# EAGLE design PatchPanel2015 (EAGLE 6.6.0)
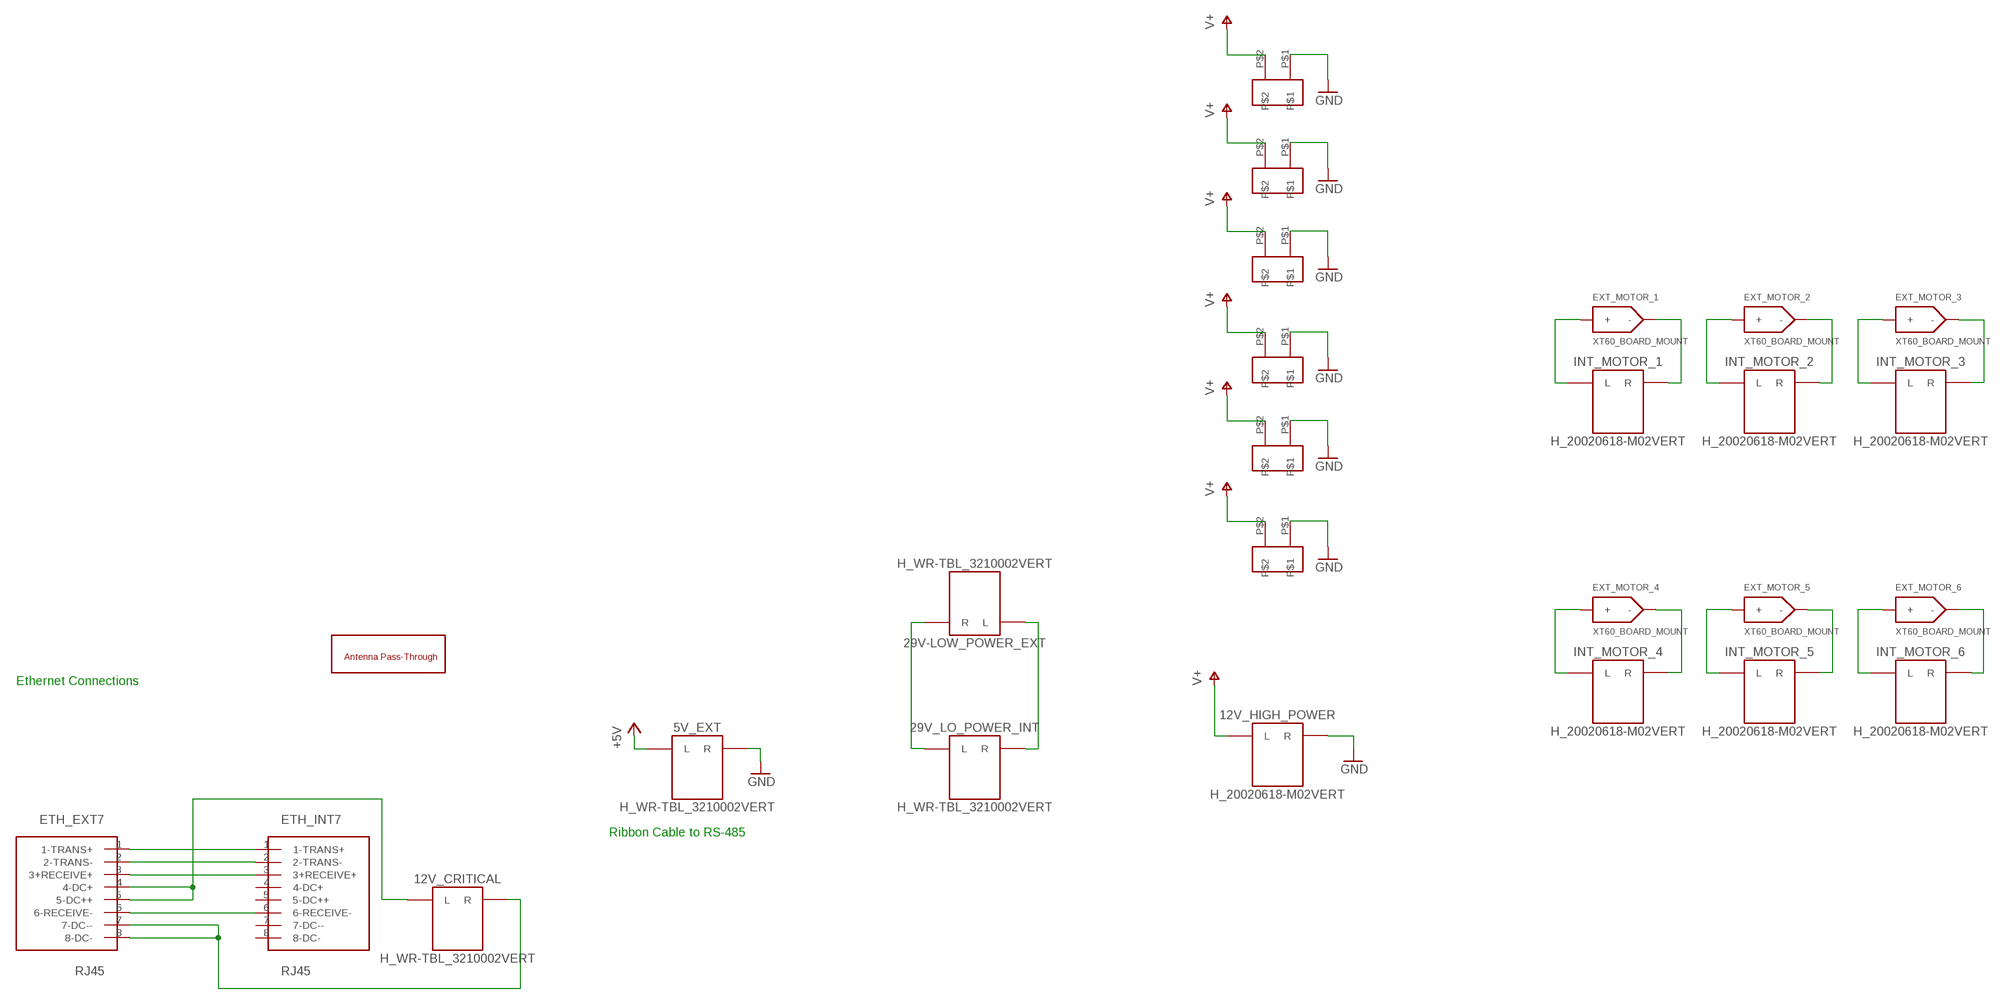
[diagram p0: schematic, sheet 1, part 1 of 2]
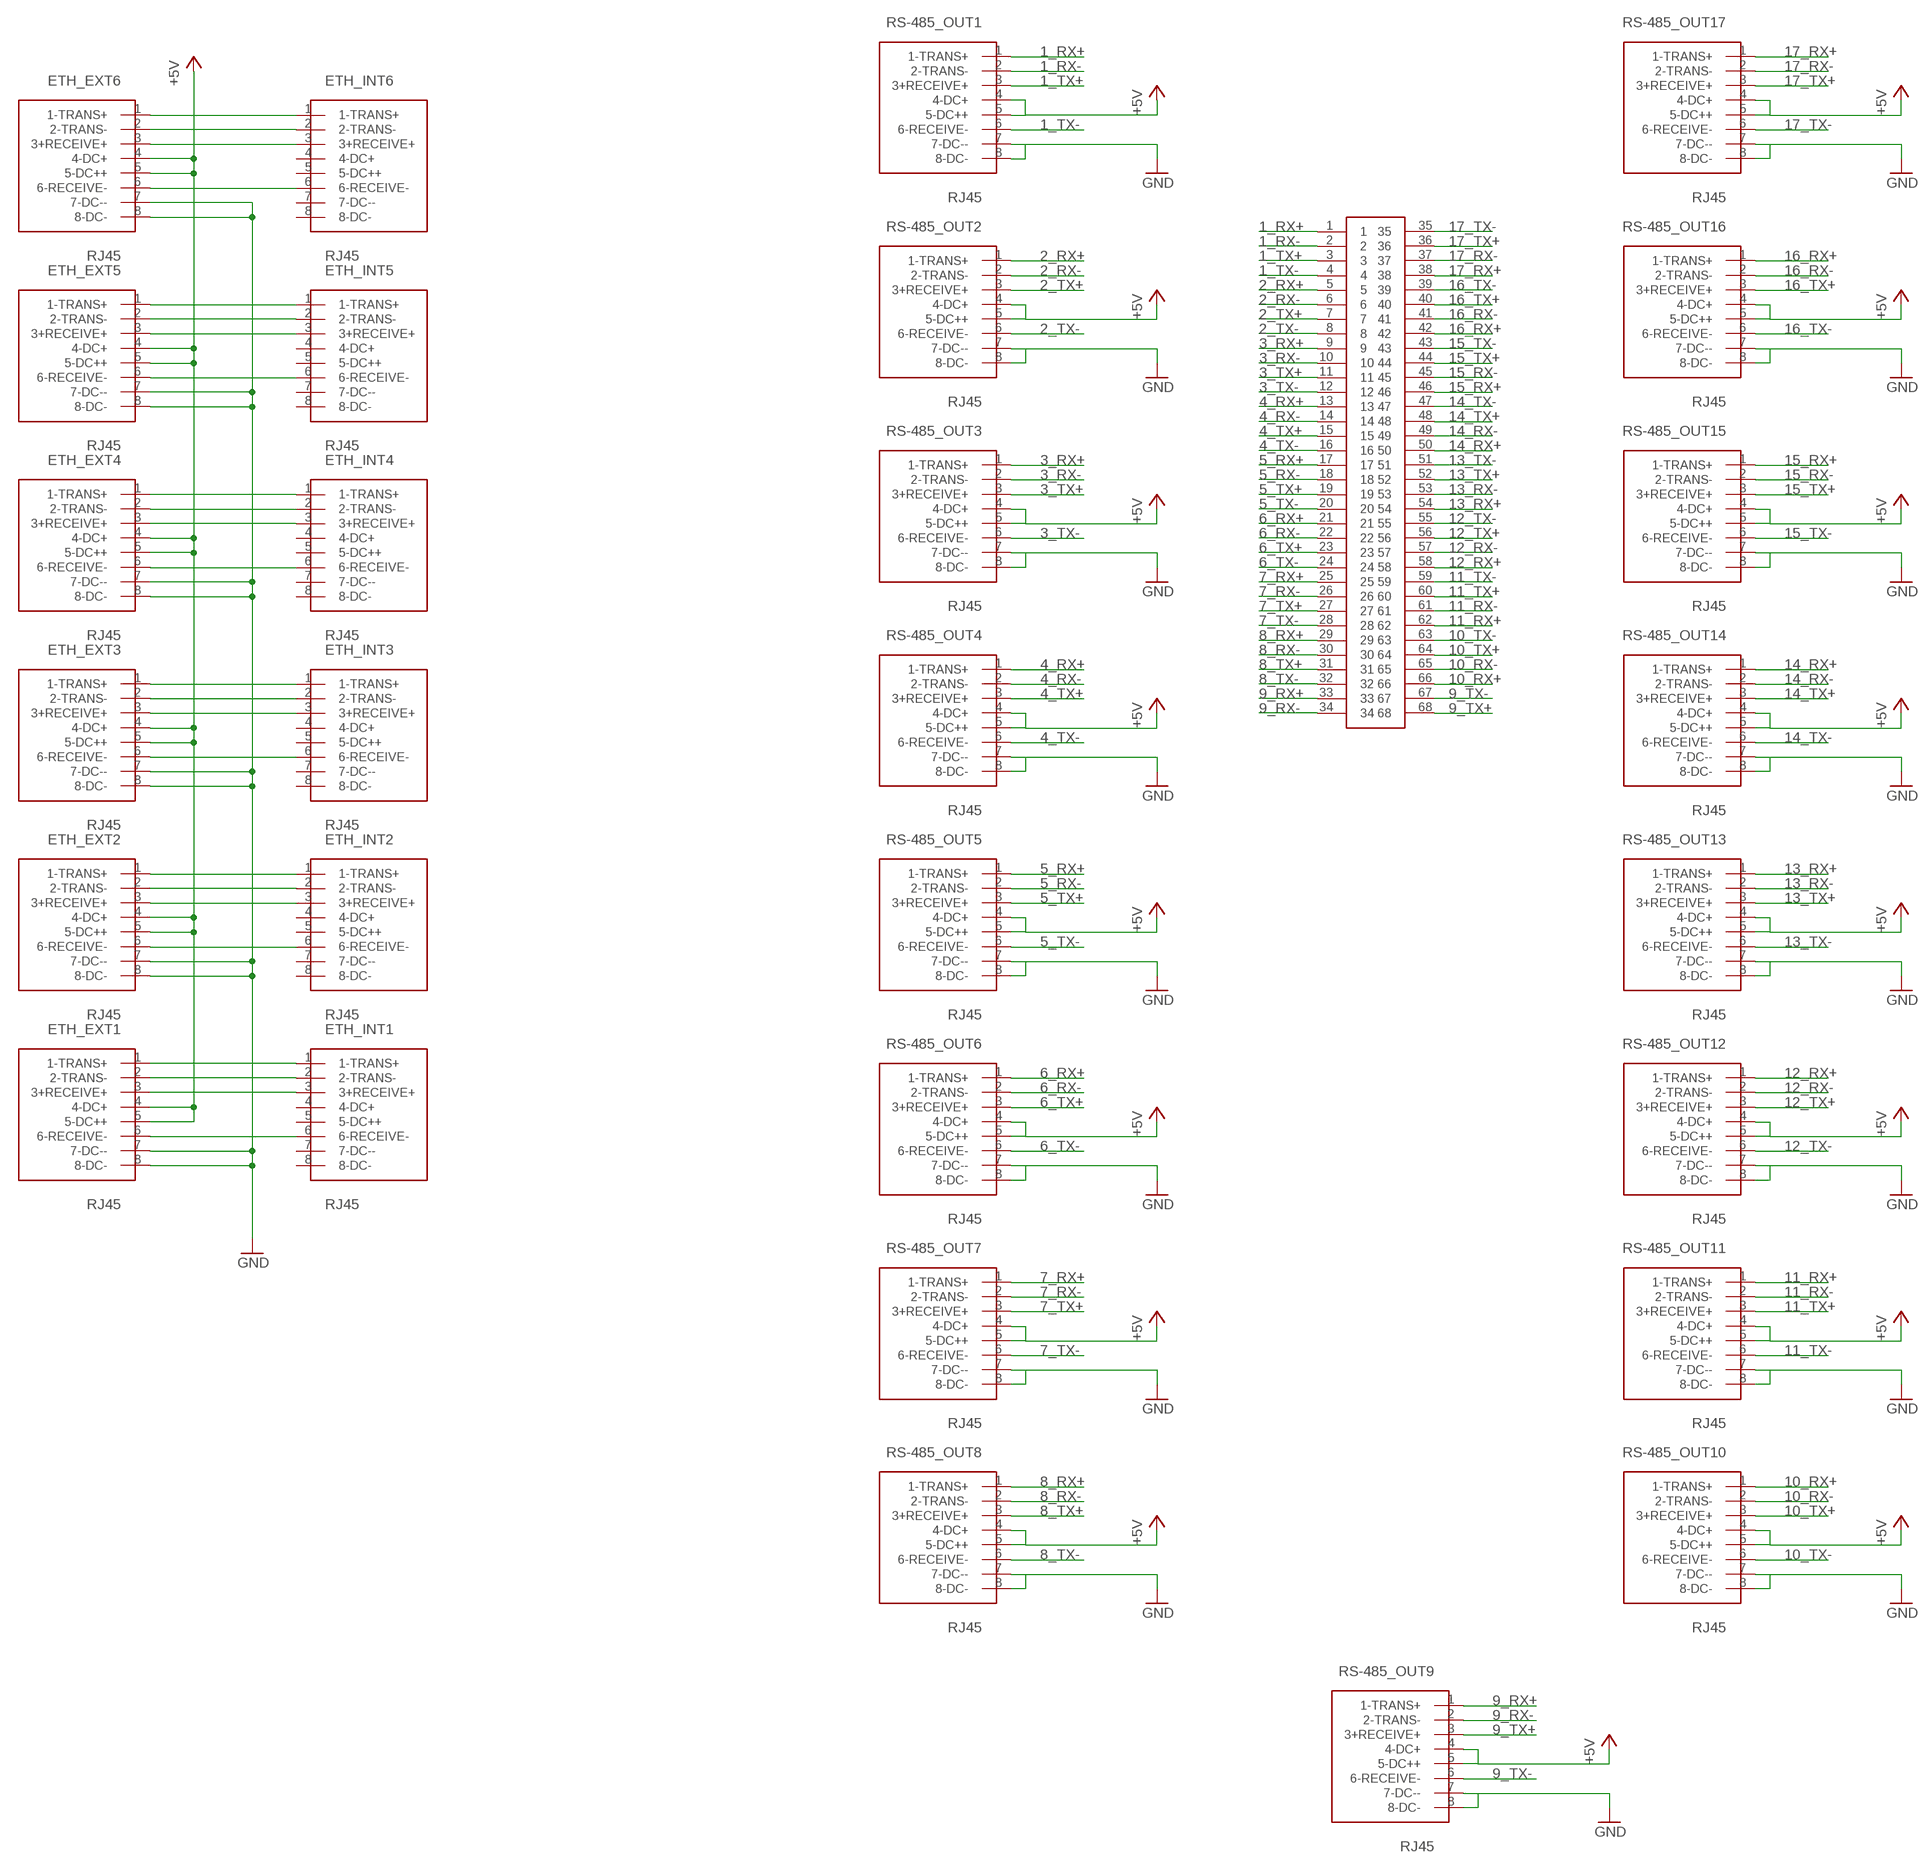
[diagram p1: schematic, sheet 1, part 2 of 2]

## Parts
5V_EXT  H_WR-TBL_3210002VERT  [691321100002]
12V_CRITICAL  H_WR-TBL_3210002VERT  [691321100002]
12V_HIGH_POWER  H_20020618-M02VERT  [20020620-M02]
29V-LOW_POWER_EXT  H_WR-TBL_3210002VERT  [691321100002]
29V_LO_POWER_INT  H_WR-TBL_3210002VERT  [691321100002]
ETH_EXT1  RJ45  [RJ45-CAT5E]
ETH_EXT2  RJ45  [RJ45-CAT5E]
ETH_EXT3  RJ45  [RJ45-CAT5E]
ETH_EXT4  RJ45  [RJ45-CAT5E]
ETH_EXT5  RJ45  [RJ45-CAT5E]
ETH_EXT6  RJ45  [RJ45-CAT5E]
ETH_EXT7  RJ45  [RJ45-CAT5E]
ETH_INT1  RJ45  [RJ45-CAT5E]
ETH_INT2  RJ45  [RJ45-CAT5E]
ETH_INT3  RJ45  [RJ45-CAT5E]
ETH_INT4  RJ45  [RJ45-CAT5E]
ETH_INT5  RJ45  [RJ45-CAT5E]
ETH_INT6  RJ45  [RJ45-CAT5E]
ETH_INT7  RJ45  [RJ45-CAT5E]
EXT_MOTOR_1  XT60_BOARD_MOUNT  [XT60_BOARD]
EXT_MOTOR_2  XT60_BOARD_MOUNT  [XT60_BOARD]
EXT_MOTOR_3  XT60_BOARD_MOUNT  [XT60_BOARD]
EXT_MOTOR_4  XT60_BOARD_MOUNT  [XT60_BOARD]
EXT_MOTOR_5  XT60_BOARD_MOUNT  [XT60_BOARD]
EXT_MOTOR_6  XT60_BOARD_MOUNT  [XT60_BOARD]
INT_MOTOR_1  H_20020618-M02VERT  [20020620-M02]
INT_MOTOR_2  H_20020618-M02VERT  [20020620-M02]
INT_MOTOR_3  H_20020618-M02VERT  [20020620-M02]
INT_MOTOR_4  H_20020618-M02VERT  [20020620-M02]
INT_MOTOR_5  H_20020618-M02VERT  [20020620-M02]
INT_MOTOR_6  H_20020618-M02VERT  [20020620-M02]
RS-485_OUT1  RJ45  [RJ45-CAT5E]
RS-485_OUT2  RJ45  [RJ45-CAT5E]
RS-485_OUT3  RJ45  [RJ45-CAT5E]
RS-485_OUT4  RJ45  [RJ45-CAT5E]
RS-485_OUT5  RJ45  [RJ45-CAT5E]
RS-485_OUT6  RJ45  [RJ45-CAT5E]
RS-485_OUT7  RJ45  [RJ45-CAT5E]
RS-485_OUT8  RJ45  [RJ45-CAT5E]
RS-485_OUT9  RJ45  [RJ45-CAT5E]
RS-485_OUT10  RJ45  [RJ45-CAT5E]
RS-485_OUT11  RJ45  [RJ45-CAT5E]
RS-485_OUT12  RJ45  [RJ45-CAT5E]
RS-485_OUT13  RJ45  [RJ45-CAT5E]
RS-485_OUT14  RJ45  [RJ45-CAT5E]
RS-485_OUT15  RJ45  [RJ45-CAT5E]
RS-485_OUT16  RJ45  [RJ45-CAT5E]
RS-485_OUT17  RJ45  [RJ45-CAT5E]
U$1  MLX-2  [42002-2]
U$2  MLX-2  [42002-2]
U$3  MLX-2  [42002-2]
U$4  TB60050685100  [60050685100]
U$5  MLX-2  [42002-2]
U$6  MLX-2  [42002-2]
U$8  MLX-2  [42002-2]
U$16  SMA-THRU  [SMA]

## Nets
1_RX+: RS-485_OUT1.1(1-TRANS+) U$4.1
1_RX-: RS-485_OUT1.2(2-TRANS-) U$4.2
1_TX+: RS-485_OUT1.3(3+RECEIVE+) U$4.3
1_TX-: RS-485_OUT1.6(6-RECEIVE-) U$4.4
2_RX+: RS-485_OUT2.1(1-TRANS+) U$4.5
2_RX-: RS-485_OUT2.2(2-TRANS-) U$4.6
2_TX+: RS-485_OUT2.3(3+RECEIVE+) U$4.7
2_TX-: RS-485_OUT2.6(6-RECEIVE-) U$4.8
3_RX+: RS-485_OUT3.1(1-TRANS+) U$4.9
3_RX-: RS-485_OUT3.2(2-TRANS-) U$4.10
3_TX+: RS-485_OUT3.3(3+RECEIVE+) U$4.11
3_TX-: RS-485_OUT3.6(6-RECEIVE-) U$4.12
4_RX+: RS-485_OUT4.1(1-TRANS+) U$4.13
4_RX-: RS-485_OUT4.2(2-TRANS-) U$4.14
4_TX+: RS-485_OUT4.3(3+RECEIVE+) U$4.15
4_TX-: RS-485_OUT4.6(6-RECEIVE-) U$4.16
5_RX+: RS-485_OUT5.1(1-TRANS+) U$4.17
5_RX-: RS-485_OUT5.2(2-TRANS-) U$4.18
5_TX+: RS-485_OUT5.3(3+RECEIVE+) U$4.19
5_TX-: RS-485_OUT5.6(6-RECEIVE-) U$4.20
6_RX+: RS-485_OUT6.1(1-TRANS+) U$4.21
6_RX-: RS-485_OUT6.2(2-TRANS-) U$4.22
6_TX+: RS-485_OUT6.3(3+RECEIVE+) U$4.23
6_TX-: RS-485_OUT6.6(6-RECEIVE-) U$4.24
7_RX+: RS-485_OUT7.1(1-TRANS+) U$4.25
7_RX-: RS-485_OUT7.2(2-TRANS-) U$4.26
7_TX+: RS-485_OUT7.3(3+RECEIVE+) U$4.27
7_TX-: RS-485_OUT7.6(6-RECEIVE-) U$4.28
8_RX+: RS-485_OUT8.1(1-TRANS+) U$4.29
8_RX-: RS-485_OUT8.2(2-TRANS-) U$4.30
8_TX+: RS-485_OUT8.3(3+RECEIVE+) U$4.31
8_TX-: RS-485_OUT8.6(6-RECEIVE-) U$4.32
9_RX+: RS-485_OUT9.1(1-TRANS+) U$4.33
9_RX-: RS-485_OUT9.2(2-TRANS-) U$4.34
9_TX+: RS-485_OUT9.3(3+RECEIVE+) U$4.68
9_TX-: RS-485_OUT9.6(6-RECEIVE-) U$4.67
10_RX+: RS-485_OUT10.1(1-TRANS+) U$4.66
10_RX-: RS-485_OUT10.2(2-TRANS-) U$4.65
10_TX+: RS-485_OUT10.3(3+RECEIVE+) U$4.64
10_TX-: RS-485_OUT10.6(6-RECEIVE-) U$4.63
11_RX+: RS-485_OUT11.1(1-TRANS+) U$4.62
11_RX-: RS-485_OUT11.2(2-TRANS-) U$4.61
11_TX+: RS-485_OUT11.3(3+RECEIVE+) U$4.60
11_TX-: RS-485_OUT11.6(6-RECEIVE-) U$4.59
12_RX+: RS-485_OUT12.1(1-TRANS+) U$4.58
12_RX-: RS-485_OUT12.2(2-TRANS-) U$4.57
12_TX+: RS-485_OUT12.3(3+RECEIVE+) U$4.56
12_TX-: RS-485_OUT12.6(6-RECEIVE-) U$4.55
13_RX+: RS-485_OUT13.1(1-TRANS+) U$4.54
13_RX-: RS-485_OUT13.2(2-TRANS-) U$4.53
13_TX+: RS-485_OUT13.3(3+RECEIVE+) U$4.52
13_TX-: RS-485_OUT13.6(6-RECEIVE-) U$4.51
14_RX+: RS-485_OUT14.1(1-TRANS+) U$4.50
14_RX-: RS-485_OUT14.2(2-TRANS-) U$4.49
14_TX+: RS-485_OUT14.3(3+RECEIVE+) U$4.48
14_TX-: RS-485_OUT14.6(6-RECEIVE-) U$4.47
15_RX+: RS-485_OUT15.1(1-TRANS+) U$4.46
15_RX-: RS-485_OUT15.2(2-TRANS-) U$4.45
15_TX+: RS-485_OUT15.3(3+RECEIVE+) U$4.44
15_TX-: RS-485_OUT15.6(6-RECEIVE-) U$4.43
16_RX+: RS-485_OUT16.1(1-TRANS+) U$4.42
16_RX-: RS-485_OUT16.2(2-TRANS-) U$4.41
16_TX+: RS-485_OUT16.3(3+RECEIVE+) U$4.40
16_TX-: RS-485_OUT16.6(6-RECEIVE-) U$4.39
17_RX+: RS-485_OUT17.1(1-TRANS+) U$4.38
17_RX-: RS-485_OUT17.2(2-TRANS-) U$4.37
17_TX+: RS-485_OUT17.3(3+RECEIVE+) U$4.36
17_TX-: RS-485_OUT17.6(6-RECEIVE-) U$4.35
+5V: 5V_EXT.L ETH_EXT1.4(4-DC+) ETH_EXT1.5(5-DC++) ETH_EXT2.4(4-DC+) ETH_EXT2.5(5-DC++) ETH_EXT3.4(4-DC+) ETH_EXT3.5(5-DC++) ETH_EXT4.4(4-DC+) ETH_EXT4.5(5-DC++) ETH_EXT5.4(4-DC+) ETH_EXT5.5(5-DC++) ETH_EXT6.4(4-DC+) ETH_EXT6.5(5-DC++) RS-485_OUT1.4(4-DC+) RS-485_OUT1.5(5-DC++) RS-485_OUT2.4(4-DC+) RS-485_OUT2.5(5-DC++) RS-485_OUT3.4(4-DC+) RS-485_OUT3.5(5-DC++) RS-485_OUT4.4(4-DC+) RS-485_OUT4.5(5-DC++) RS-485_OUT5.4(4-DC+) RS-485_OUT5.5(5-DC++) RS-485_OUT6.4(4-DC+) RS-485_OUT6.5(5-DC++) RS-485_OUT7.4(4-DC+) RS-485_OUT7.5(5-DC++) RS-485_OUT8.4(4-DC+) RS-485_OUT8.5(5-DC++) RS-485_OUT9.4(4-DC+) RS-485_OUT9.5(5-DC++) RS-485_OUT10.4(4-DC+) RS-485_OUT10.5(5-DC++) RS-485_OUT11.4(4-DC+) RS-485_OUT11.5(5-DC++) RS-485_OUT12.4(4-DC+) RS-485_OUT12.5(5-DC++) RS-485_OUT13.4(4-DC+) RS-485_OUT13.5(5-DC++) RS-485_OUT14.4(4-DC+) RS-485_OUT14.5(5-DC++) RS-485_OUT15.4(4-DC+) RS-485_OUT15.5(5-DC++) RS-485_OUT16.4(4-DC+) RS-485_OUT16.5(5-DC++) RS-485_OUT17.4(4-DC+) RS-485_OUT17.5(5-DC++)
GND: 5V_EXT.R 12V_HIGH_POWER.R1(R) 12V_HIGH_POWER.R2(R) ETH_EXT1.7(7-DC--) ETH_EXT1.8(8-DC-) ETH_EXT2.7(7-DC--) ETH_EXT2.8(8-DC-) ETH_EXT3.7(7-DC--) ETH_EXT3.8(8-DC-) ETH_EXT4.7(7-DC--) ETH_EXT4.8(8-DC-) ETH_EXT5.7(7-DC--) ETH_EXT5.8(8-DC-) ETH_EXT6.7(7-DC--) ETH_EXT6.8(8-DC-) RS-485_OUT1.7(7-DC--) RS-485_OUT1.8(8-DC-) RS-485_OUT2.7(7-DC--) RS-485_OUT2.8(8-DC-) RS-485_OUT3.7(7-DC--) RS-485_OUT3.8(8-DC-) RS-485_OUT4.7(7-DC--) RS-485_OUT4.8(8-DC-) RS-485_OUT5.7(7-DC--) RS-485_OUT5.8(8-DC-) RS-485_OUT6.7(7-DC--) RS-485_OUT6.8(8-DC-) RS-485_OUT7.7(7-DC--) RS-485_OUT7.8(8-DC-) RS-485_OUT8.7(7-DC--) RS-485_OUT8.8(8-DC-) RS-485_OUT9.7(7-DC--) RS-485_OUT9.8(8-DC-) RS-485_OUT10.7(7-DC--) RS-485_OUT10.8(8-DC-) RS-485_OUT11.7(7-DC--) RS-485_OUT11.8(8-DC-) RS-485_OUT12.7(7-DC--) RS-485_OUT12.8(8-DC-) RS-485_OUT13.7(7-DC--) RS-485_OUT13.8(8-DC-) RS-485_OUT14.7(7-DC--) RS-485_OUT14.8(8-DC-) RS-485_OUT15.7(7-DC--) RS-485_OUT15.8(8-DC-) RS-485_OUT16.7(7-DC--) RS-485_OUT16.8(8-DC-) RS-485_OUT17.7(7-DC--) RS-485_OUT17.8(8-DC-) U$1.P$1 U$2.P$1 U$3.P$1 U$5.P$1 U$6.P$1 U$8.P$1
N$1: ETH_EXT1.1(1-TRANS+) ETH_INT1.1(1-TRANS+)
N$2: ETH_EXT1.2(2-TRANS-) ETH_INT1.2(2-TRANS-)
N$3: ETH_EXT1.3(3+RECEIVE+) ETH_INT1.3(3+RECEIVE+)
N$4: EXT_MOTOR_1.POS(+) INT_MOTOR_1.L1(L) INT_MOTOR_1.L2(L)
N$5: EXT_MOTOR_1.NEG(-) INT_MOTOR_1.R1(R) INT_MOTOR_1.R2(R)
N$6: ETH_EXT1.6(6-RECEIVE-) ETH_INT1.6(6-RECEIVE-)
N$7: EXT_MOTOR_2.POS(+) INT_MOTOR_2.L1(L) INT_MOTOR_2.L2(L)
N$8: EXT_MOTOR_2.NEG(-) INT_MOTOR_2.R1(R) INT_MOTOR_2.R2(R)
N$9: ETH_EXT2.1(1-TRANS+) ETH_INT2.1(1-TRANS+)
N$10: ETH_EXT2.2(2-TRANS-) ETH_INT2.2(2-TRANS-)
N$11: ETH_EXT2.3(3+RECEIVE+) ETH_INT2.3(3+RECEIVE+)
N$12: EXT_MOTOR_3.POS(+) INT_MOTOR_3.L1(L) INT_MOTOR_3.L2(L)
N$13: EXT_MOTOR_3.NEG(-) INT_MOTOR_3.R1(R) INT_MOTOR_3.R2(R)
N$14: ETH_EXT2.6(6-RECEIVE-) ETH_INT2.6(6-RECEIVE-)
N$15: EXT_MOTOR_4.POS(+) INT_MOTOR_4.L1(L) INT_MOTOR_4.L2(L)
N$16: EXT_MOTOR_4.NEG(-) INT_MOTOR_4.R1(R) INT_MOTOR_4.R2(R)
N$17: ETH_EXT3.1(1-TRANS+) ETH_INT3.1(1-TRANS+)
N$18: ETH_EXT3.2(2-TRANS-) ETH_INT3.2(2-TRANS-)
N$19: ETH_EXT3.3(3+RECEIVE+) ETH_INT3.3(3+RECEIVE+)
N$20: EXT_MOTOR_5.POS(+) INT_MOTOR_5.L1(L) INT_MOTOR_5.L2(L)
N$21: EXT_MOTOR_5.NEG(-) INT_MOTOR_5.R1(R) INT_MOTOR_5.R2(R)
N$22: ETH_EXT3.6(6-RECEIVE-) ETH_INT3.6(6-RECEIVE-)
N$23: EXT_MOTOR_6.POS(+) INT_MOTOR_6.L1(L) INT_MOTOR_6.L2(L)
N$24: EXT_MOTOR_6.NEG(-) INT_MOTOR_6.R1(R) INT_MOTOR_6.R2(R)
N$25: 29V-LOW_POWER_EXT.R 29V_LO_POWER_INT.L
N$27: ETH_EXT4.6(6-RECEIVE-) ETH_INT4.6(6-RECEIVE-)
N$28: 29V-LOW_POWER_EXT.L 29V_LO_POWER_INT.R
N$29: 12V_CRITICAL.L ETH_EXT7.4(4-DC+) ETH_EXT7.5(5-DC++)
N$30: ETH_EXT4.3(3+RECEIVE+) ETH_INT4.3(3+RECEIVE+)
N$31: ETH_EXT4.2(2-TRANS-) ETH_INT4.2(2-TRANS-)
N$32: ETH_EXT4.1(1-TRANS+) ETH_INT4.1(1-TRANS+)
N$33: 12V_CRITICAL.R ETH_EXT7.7(7-DC--) ETH_EXT7.8(8-DC-)
N$35: ETH_EXT5.6(6-RECEIVE-) ETH_INT5.6(6-RECEIVE-)
N$38: ETH_EXT5.3(3+RECEIVE+) ETH_INT5.3(3+RECEIVE+)
N$39: ETH_EXT5.2(2-TRANS-) ETH_INT5.2(2-TRANS-)
N$40: ETH_EXT5.1(1-TRANS+) ETH_INT5.1(1-TRANS+)
N$41: ETH_EXT6.1(1-TRANS+) ETH_INT6.1(1-TRANS+)
N$42: ETH_EXT6.2(2-TRANS-) ETH_INT6.2(2-TRANS-)
N$43: ETH_EXT6.3(3+RECEIVE+) ETH_INT6.3(3+RECEIVE+)
N$46: ETH_EXT6.6(6-RECEIVE-) ETH_INT6.6(6-RECEIVE-)
N$61: ETH_EXT7.1(1-TRANS+) ETH_INT7.1(1-TRANS+)
N$62: ETH_EXT7.2(2-TRANS-) ETH_INT7.2(2-TRANS-)
N$63: ETH_EXT7.3(3+RECEIVE+) ETH_INT7.3(3+RECEIVE+)
N$66: ETH_EXT7.6(6-RECEIVE-) ETH_INT7.6(6-RECEIVE-)
V+: 12V_HIGH_POWER.L1(L) 12V_HIGH_POWER.L2(L) U$1.P$2 U$2.P$2 U$3.P$2 U$5.P$2 U$6.P$2 U$8.P$2
Unconnected: ETH_INT1.4(4-DC+) ETH_INT1.5(5-DC++) ETH_INT1.7(7-DC--) ETH_INT1.8(8-DC-) ETH_INT2.4(4-DC+) ETH_INT2.5(5-DC++) ETH_INT2.7(7-DC--) ETH_INT2.8(8-DC-) ETH_INT3.4(4-DC+) ETH_INT3.5(5-DC++) ETH_INT3.7(7-DC--) ETH_INT3.8(8-DC-) ETH_INT4.4(4-DC+) ETH_INT4.5(5-DC++) ETH_INT4.7(7-DC--) ETH_INT4.8(8-DC-) ETH_INT5.4(4-DC+) ETH_INT5.5(5-DC++) ETH_INT5.7(7-DC--) ETH_INT5.8(8-DC-) ETH_INT6.4(4-DC+) ETH_INT6.5(5-DC++) ETH_INT6.7(7-DC--) ETH_INT6.8(8-DC-) ETH_INT7.4(4-DC+) ETH_INT7.5(5-DC++) ETH_INT7.7(7-DC--) ETH_INT7.8(8-DC-)

## Notes on the sheet
- Ethernet Connections
- Ribbon Cable to RS-485

## Library data of the parts
5V_EXT 12V_CRITICAL 29V-LOW_POWER_EXT 29V_LO_POWER_INT = MRDT-2015-PowerBoard:H_WR-TBL_32*1*0002: Wurth Electronic's 2-pin 10A pluggable screw terminal headers. Vertical and Horizantal Part Numbers: 691322110002 (Horizantal) 691321100002 (Vertical); DIGIKEY_PN: 732-2763-ND
12V_HIGH_POWER INT_MOTOR_1-INT_MOTOR_6 = MRDT-2015-PowerBoard:H_20020618-M02*: High amp pluggable screw terminal from FCI. Rated up to 32A Horizantal variant is 20020618-M02* Vertical variant is 20020620-M02*; DIGIKEY_PN: 609-3948-ND
ETH_EXT1-ETH_EXT7 ETH_INT1-ETH_INT7 RS-485_OUT1-RS-485_OUT17 = PCB0M1:RJ45
EXT_MOTOR_1-EXT_MOTOR_6 = MRDT-2015-PowerBoard:XT60_BOARD_MOUNT
U$1-U$3 U$5 U$6 U$8 = MLX:MLX-2
U$4 = harting-scsi:TB60050685100
U$16 = ant-pass-through:SMA-THRU

## Board
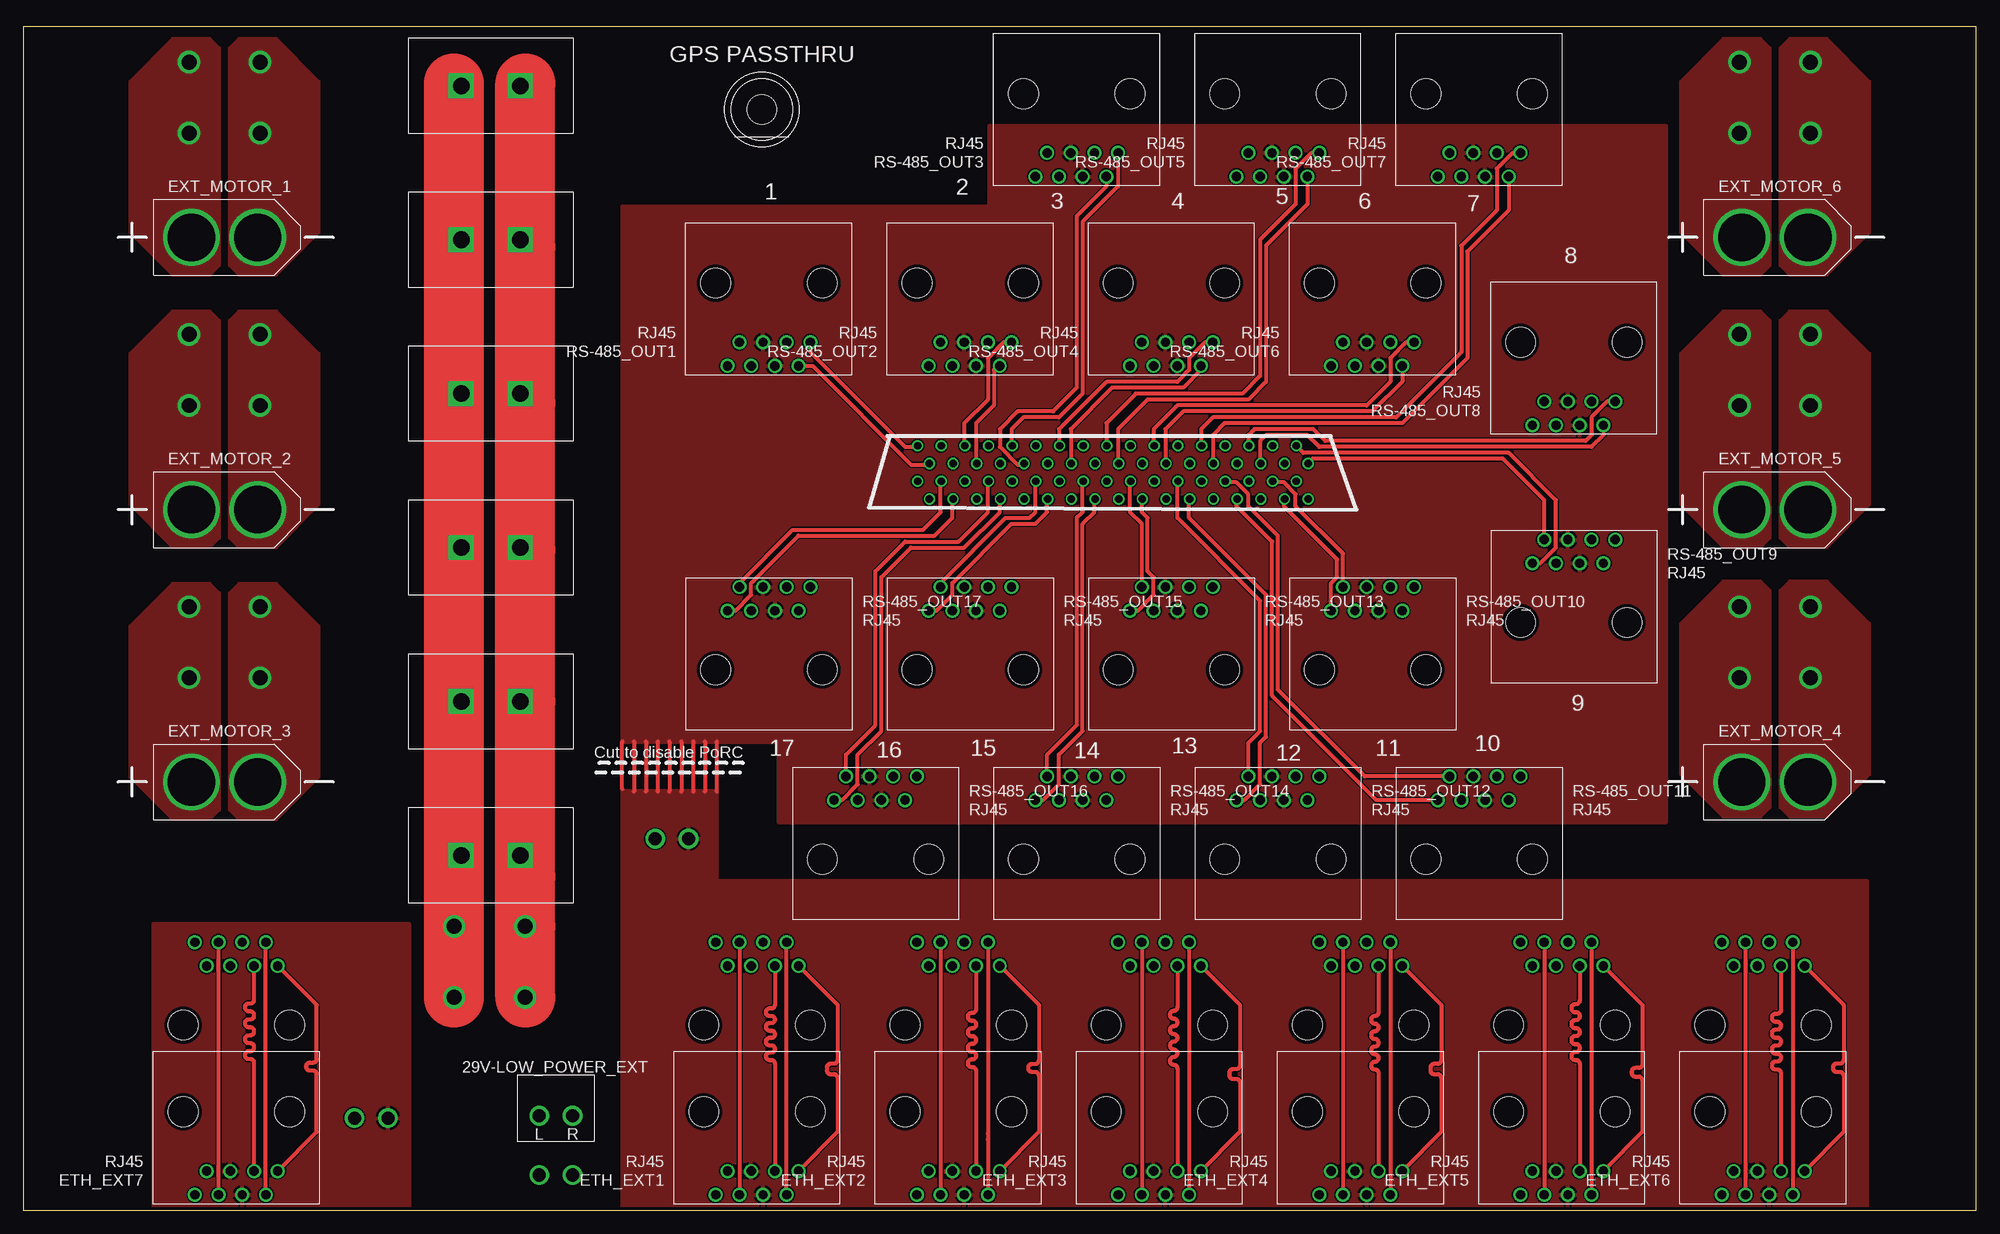
[diagram p2: board, top side]
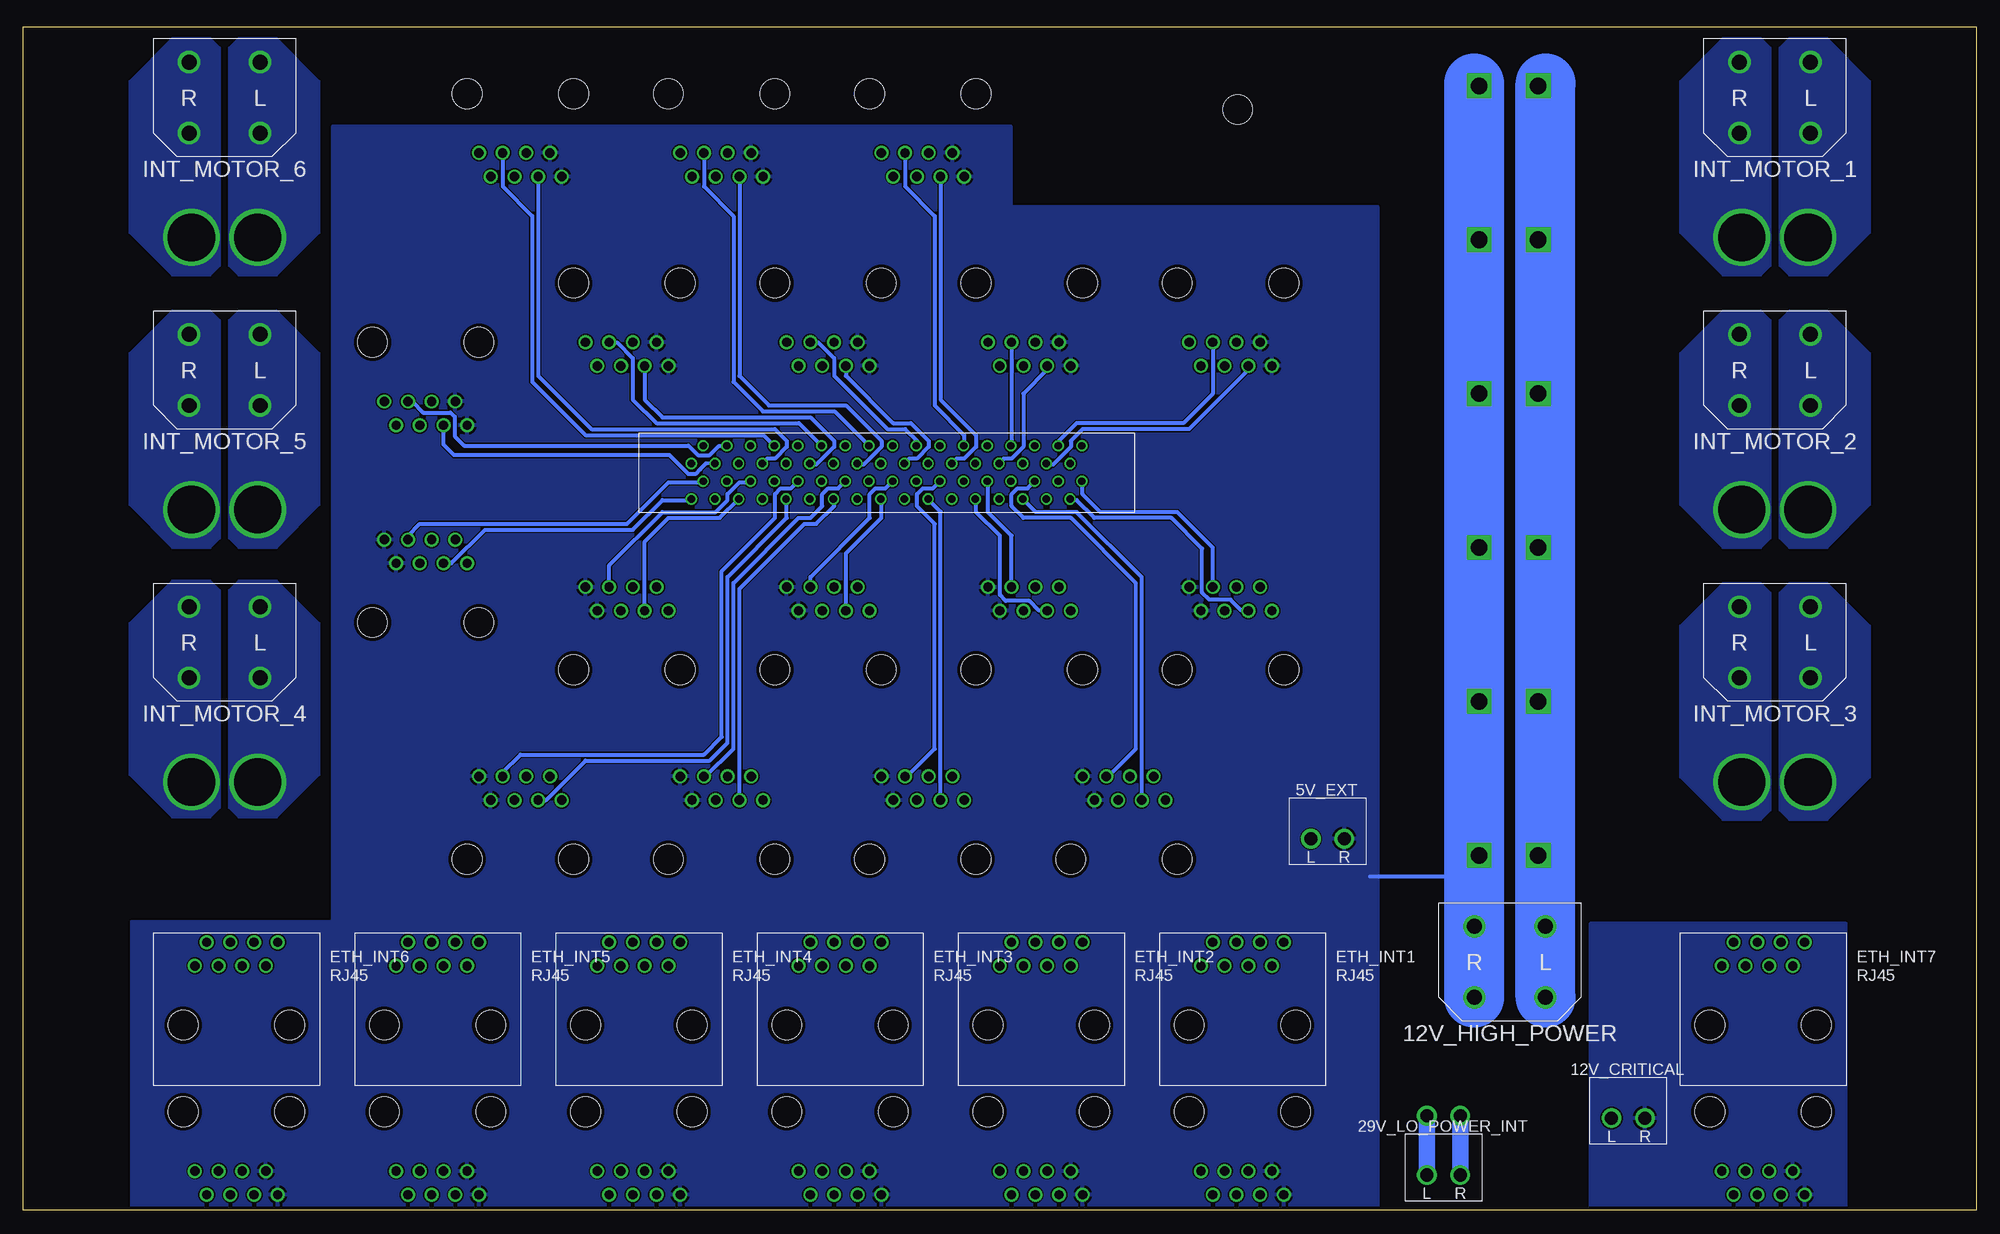
[diagram p3: board, bottom side, seen from below]

Size 209.55 x 127 mm. Coordinates in mm from the lower left corner, seen from the top.
Outline: 0,0 209.55,0 209.55,127 0,127 0,0
Copper layers (1*16): Top 0.0356mm / dielectric 1.5011mm / Bottom 0.0356mm
Design rules "OSHPark": minimum track width 6mil, minimum drill 13mil, track to track 6mil, track to pad 6mil, pad to pad 6mil, via to via 6mil, smd to smd 6mil, copper to edge 15mil, drill to drill 6mil, minimum pad ring 7mil, minimum via ring 7mil, stop-mask expansion 3mil, vias tented up to drill 0mil, thermal gap 10mil

### Footprints (pad centres in the part's own frame; a part is rotated, then mirrored left to right if it is on the bottom)
691321100002 = drill 1.4: L -1.79,0; R 1.79,0
20020620-M02 = drill 1.6: L1 -3.81,7.62; L2 -3.81,0; R1 3.81,7.62; R2 3.81,0
RJ45-CAT5E = drill 1: 1 -4.445,4.655; 2 -3.175,7.195; 3 -1.905,4.655; 4 -0.635,7.195; 5 0.635,4.655; 6 1.905,7.195; 7 3.175,4.655; 8 4.445,7.195 | hole 3.2: 5.715,-1.695; -5.715,-1.695
XT60_BOARD = drill 5.08: NEG 11.176,4.064; POS 4.064,4.064
42002-2 = drill 1.778 square: P$1 0,0; P$2 6.35,0
60050685100 = drill 0.8: 1 47.555,7.107; 2 46.285,5.202; 3 45.015,7.107; 4 43.745,5.202; 5 42.475,7.107; 6 41.205,5.202; 7 39.935,7.107; 8 38.665,5.202; 9 37.395,7.107; 10 36.125,5.202; 11 34.855,7.107; 12 33.585,5.202; 13 32.315,7.107; 14 31.045,5.202; 15 29.775,7.107; 16 28.505,5.202; 17 27.235,7.107; 18 25.965,5.202; 19 24.695,7.107; 20 23.425,5.202; 21 22.155,7.107; 22 20.885,5.202; 23 19.615,7.107; 24 18.345,5.202; 25 17.075,7.107; 26 15.805,5.202; 27 14.535,7.107; 28 13.265,5.202; 29 11.995,7.107; 30 10.725,5.202; 31 9.455,7.107; 32 8.185,5.202; 33 6.915,7.107; 34 5.645,5.202; 35 47.555,3.297; 36 46.285,1.393; 37 45.015,3.297; 38 43.745,1.393; 39 42.475,3.297; 40 41.205,1.393; 41 39.935,3.297; 42 38.665,1.393; 43 37.395,3.297; 44 36.125,1.393; 45 34.855,3.297; 46 33.585,1.393; 47 32.315,3.297; 48 31.045,1.393; 49 29.775,3.297; 50 28.505,1.393; 51 27.235,3.297; 52 25.965,1.393; 53 24.695,3.297; 54 23.425,1.393; 55 22.155,3.297; 56 20.885,1.393; 57 19.615,3.297; 58 18.345,1.393; 59 17.075,3.297; 60 15.805,1.393; 61 14.535,3.297; 62 13.265,1.393; 63 11.995,3.297; 64 10.725,1.393; 65 9.455,3.297; 66 8.185,1.393; 67 6.915,3.297; 68 5.645,1.393
SMA = hole 3.2: 0,0

### Placement (x,y rotation side)
5V_EXT  H_WR-TBL_321*0002VERT  [691321100002]  69.6,39.88 0 bottom
12V_CRITICAL  H_WR-TBL_321*0002VERT  [691321100002]  37.34,9.91 0 bottom
12V_HIGH_POWER  50.04,30.48 180 bottom
29V-LOW_POWER_EXT  H_WR-TBL_321*0002VERT  [691321100002]  57.15,10.16 0 top
29V_LO_POWER_INT  H_WR-TBL_321*0002VERT  [691321100002]  57.15,3.81 0 bottom
ETH_EXT1  78.74,8.89 180 top
ETH_EXT2  100.33,8.89 180 top
ETH_EXT3  121.92,8.89 180 top
ETH_EXT4  143.51,8.89 180 top
ETH_EXT5  165.1,8.89 180 top
ETH_EXT6  186.69,8.89 180 top
ETH_EXT7  22.86,8.89 180 top
ETH_INT1  78.74,21.59 0 bottom
ETH_INT2  100.33,21.59 0 bottom
ETH_INT3  121.92,21.59 0 bottom
ETH_INT4  143.51,21.59 0 bottom
ETH_INT5  165.1,21.59 0 bottom
ETH_INT6  186.69,21.59 0 bottom
ETH_INT7  22.86,21.59 0 bottom
EXT_MOTOR_1  13.97,100.33 0 top
EXT_MOTOR_2  13.97,71.12 0 top
EXT_MOTOR_3  13.97,41.91 0 top
EXT_MOTOR_4  180.34,41.91 0 top
EXT_MOTOR_5  180.34,71.12 0 top
EXT_MOTOR_6  180.34,100.33 0 top
INT_MOTOR_1  21.59,123.19 180 bottom
INT_MOTOR_2  21.59,93.98 180 bottom
INT_MOTOR_3  21.59,64.77 180 bottom
INT_MOTOR_4  187.96,64.77 180 bottom
INT_MOTOR_5  187.96,93.98 180 bottom
INT_MOTOR_6  187.96,123.19 180 bottom
RS-485_OUT1  80.01,97.79 180 top
RS-485_OUT2  101.6,97.79 180 top
RS-485_OUT3  113.03,118.11 180 top
RS-485_OUT4  123.19,97.79 180 top
RS-485_OUT5  134.62,118.11 180 top
RS-485_OUT6  144.78,97.79 180 top
RS-485_OUT7  156.21,118.11 180 top
RS-485_OUT8  166.37,91.44 180 top
RS-485_OUT9  166.37,64.77 0 top
RS-485_OUT10  144.78,59.69 0 top
RS-485_OUT11  156.21,39.37 0 top
RS-485_OUT12  134.62,39.37 0 top
RS-485_OUT13  123.19,59.69 0 top
RS-485_OUT14  113.03,39.37 0 top
RS-485_OUT15  101.6,59.69 0 top
RS-485_OUT16  91.44,39.37 0 top
RS-485_OUT17  80.01,59.69 0 top
U$1  53.34,104.14 180 top
U$2  53.34,87.63 180 top
U$3  53.34,71.12 180 top
U$4  143.51,74.93 0 bottom
U$5  53.34,54.61 180 top
U$6  53.34,38.1 180 top
U$8  53.34,120.65 180 top
U$16  79.25,118.11 0 top

### Tracks (layer width: path | path; a pad name or v marks a point on that pad's centre or on a via)
1_RX+
  Top 0.406: RS-485_OUT1.1 84.45,92.08 94.61,81.92 95.83,81.92 U$4.1
1_RX-
  Top 0.406: RS-485_OUT1.2 84.67,90.59 95.25,80.01 97.1,80.01 U$4.2
1_TX+
  Bottom 0.406: RS-485_OUT1.3 81.92,87.63 85.09,84.45 96.52,84.45 98.42,82.55 98.42,82.11 U$4.3
1_TX-
  Bottom 0.406: RS-485_OUT1.6 78.11,90.17 84.45,83.82 95.89,83.82 97.16,82.55 97.16,81.92 99.06,80.01 99.64,80.01 U$4.4
2_RX+
  Top 0.406: RS-485_OUT2.1 105.2,93.14 103.5,91.44 103.5,87 100.97,84.45 100.97,82.11 U$4.5
2_RX-
  Top 0.406: RS-485_OUT2.2 104.56,90.59 104.14,90.17 104.14,86.36 102.23,84.45 102.23,80.2 U$4.6
2_TX+
  Bottom 0.406: RS-485_OUT2.3 103.5,82.11 U$4.7
2_TX-
  Bottom 0.406: RS-485_OUT2.6 99.69,90.17 102.23,87.63 102.23,81.92 103.5,80.64 104.33,80.64 U$4.8
3_RX+
  Top 0.406: RS-485_OUT3.1 117.47,109.86 113.67,106.05 113.67,87.63 111.12,85.09 107.31,85.09 106.05,83.82 106.05,82.11 U$4.9
3_RX-
  Top 0.406: RS-485_OUT3.2 116.2,109.86 113.03,106.68 113.03,88.27 110.49,85.72 106.68,85.72 104.78,83.82 104.78,81.92 106.68,80.01 107.26,80.01 U$4.10
3_TX+
  Bottom 0.406: RS-485_OUT3.3 114.94,109.86 111.76,106.68 111.76,86.36 108.58,83.19 108.58,82.11 U$4.11
3_TX-
  Bottom 0.406: RS-485_OUT3.6 111.12,87 107.31,83.19 107.31,81.92 108.58,80.64 109.41,80.64 U$4.12
4_RX+
  Top 0.406: RS-485_OUT4.1 126.79,93.14 125.09,91.44 125.09,90.17 123.83,88.9 116.2,88.9 111.12,83.82 111.12,82.11 U$4.13
4_RX-
  Top 0.406: RS-485_OUT4.2 126.36,90.17 124.46,88.27 116.84,88.27 112.39,83.82 112.39,80.2 U$4.14
4_TX+
  Bottom 0.406: RS-485_OUT4.3 124.25,93.14 122.56,91.44 122.56,89.53 116.84,83.82 114.94,83.82 113.67,82.55 113.67,82.11 U$4.15
4_TX-
  Bottom 0.406: RS-485_OUT4.6 121.28,89.53 116.2,84.45 114.3,84.45 112.39,82.55 112.39,81.92 113.67,80.64 114.49,80.64 U$4.16
5_RX+
  Top 0.406: RS-485_OUT5.1 138.22,113.45 136.53,111.76 136.53,107.95 132.72,104.14 132.72,89.53 130.81,87.63 119.38,87.63 116.2,84.45 116.2,82.11 U$4.17
5_RX-
  Top 0.406: RS-485_OUT5.2 137.79,107.95 133.35,103.5 133.35,88.9 131.44,87 120.65,87 117.47,83.82 117.47,80.2 U$4.18
5_TX+
  Bottom 0.406: RS-485_OUT5.3 136.53,109.86 133.35,106.68 133.35,88.9 130.18,85.72 122.5,85.72 U$4.19
5_TX-
  Bottom 0.406: RS-485_OUT5.6 132.72,89.53 129.54,86.36 121.28,86.36 117.47,82.55 117.47,81.92 119.38,80.01 119.96,80.01 U$4.20
6_RX+
  Top 0.406: RS-485_OUT6.1 148.38,93.14 146.69,91.44 146.69,88.9 144.15,86.36 123.83,86.36 121.28,83.82 121.28,82.11 U$4.21
6_RX-
  Top 0.406: RS-485_OUT6.2 147.96,88.9 144.78,85.72 124.46,85.72 122.56,83.82 122.56,80.2 U$4.22
6_TX+
  Bottom 0.406: RS-485_OUT6.3 145.84,93.14 144.15,91.44 144.15,87 141.6,84.45 126.31,84.45 U$4.23
6_TX-
  Bottom 0.406: RS-485_OUT6.6 142.88,87 140.97,85.09 125.09,85.09 122.56,82.55 122.56,81.92 124.46,80.01 125.04,80.01 U$4.24
7_RX+
  Top 0.406: RS-485_OUT7.1 159.81,113.45 158.12,111.76 158.12,107.31 154.31,103.5 154.31,92.08 147.32,85.09 127.64,85.09 126.36,83.82 126.36,82.11 U$4.25
7_RX-
  Top 0.406: RS-485_OUT7.2 159.38,107.31 154.94,102.87 154.94,91.44 147.96,84.45 128.91,84.45 127.64,83.19 127.64,80.2 U$4.26
7_TX+
  Bottom 0.406: RS-485_OUT7.3 158.12,109.86 154.94,106.68 154.94,88.9 149.22,83.19 130.12,83.19 U$4.27
7_TX-
  Bottom 0.406: RS-485_OUT7.6 154.31,89.53 148.59,83.82 128.91,83.82 127.64,82.55 127.64,81.92 128.91,80.64 129.73,80.64 U$4.28
8_RX+
  Top 0.406: RS-485_OUT8.1 169.97,86.78 168.28,85.09 168.28,83.19 167.64,82.55 139.7,82.55 138.43,83.82 132.08,83.82 131.44,83.19 131.44,82.11 U$4.29
8_RX-
  Top 0.406: RS-485_OUT8.2 169.54,83.19 168.28,81.92 139.06,81.92 137.79,83.19 133.35,83.19 132.72,82.55 132.72,80.2 U$4.30
8_TX+
  Bottom 0.406: RS-485_OUT8.3 167.81,86.78 166.62,85.6 163.7,85.6 163.26,85.15 163.26,83.06 162.24,82.04 138.18,82.04 137.16,81.03 135.89,81.03 134.88,82.04 U$4.31
8_TX-
  Bottom 0.406: U$4.32 136.27,80.14 136.91,79.5 137.41,78.99 138.18,78.99 140.21,81.03 163.32,81.03 164.47,82.17 RS-485_OUT8.6
9_RX+
  Top 0.406: RS-485_OUT9.1 162.77,69.42 164.47,71.12 164.47,76.2 159.38,81.28 137.35,81.28 U$4.33
9_RX-
  Top 0.406: RS-485_OUT9.2 163.19,76.2 158.75,80.64 138.38,80.64 U$4.34
9_TX+
  Bottom 0.406: RS-485_OUT9.3 163.62,69.42 160.02,73.03 144.15,73.03 140.97,76.2 137.99,76.2 U$4.68
9_TX-
  Bottom 0.406: RS-485_OUT9.6 168.28,72.39 167,73.66 144.78,73.66 140.34,78.11 136.72,78.11 U$4.67
10_RX+
  Top 0.406: RS-485_OUT10.1 140.34,67.31 140.97,67.94 140.97,69.85 135.25,75.56 135.25,76.25 U$4.66
10_RX-
  Top 0.406: RS-485_OUT10.2 141.6,70.48 136.53,75.56 136.53,76.83 135.25,78.11 134.18,78.11 U$4.65
10_TX+
  Bottom 0.406: RS-485_OUT10.3 142.88,71.75 140.34,74.3 134.81,74.3 U$4.64
10_TX-
  Bottom 0.406: RS-485_OUT10.6 146.69,69.22 140.97,74.93 135.25,74.93 133.99,76.2 133.99,76.83 132.72,78.11 131.64,78.11 U$4.63
11_RX+
  Top 0.406: RS-485_OUT11.1 145.21,44.02 133.99,55.24 133.99,71.75 130.18,75.56 130.18,76.25 U$4.62
11_RX-
  Top 0.406: RS-485_OUT11.2 143.94,46.56 134.62,55.88 134.62,72.39 131.44,75.56 131.44,76.83 130.18,78.11 129.1,78.11 U$4.61
11_TX+
  Bottom 0.406: RS-485_OUT11.3 153.46,44.02 149.22,48.26 135.89,48.26 133.99,50.16 133.99,67.94 127.64,74.3 127.64,76.25 U$4.60
11_TX-
  Bottom 0.406: RS-485_OUT11.6 158.12,46.99 156.21,48.9 136.53,48.9 134.62,50.8 134.62,68.58 128.91,74.3 128.91,76.83 128.27,77.47 127.19,77.47 U$4.59
12_RX+
  Top 0.406: RS-485_OUT12.1 131.02,44.02 132.72,45.72 132.72,50.16 133.35,50.8 133.35,66.04 125.09,74.3 125.09,76.25 U$4.58
12_RX-
  Top 0.406: RS-485_OUT12.2 131.44,50.16 132.72,51.44 132.72,65.41 123.83,74.3 123.83,78.16 U$4.57
12_TX+
  Bottom 0.406: RS-485_OUT12.3 132.72,66.67 125.73,73.66 124.46,73.66 122.56,75.56 122.56,76.25 U$4.56
12_TX-
  Bottom 0.406: RS-485_OUT12.6 136.31,46.56 133.35,49.53 133.35,67.31 126.36,74.3 125.09,74.3 123.83,75.56 123.83,76.83 123.19,77.47 122.11,77.47 U$4.55
13_RX+
  Top 0.406: RS-485_OUT13.1 119.59,64.34 121.28,66.04 121.28,67.94 120.65,68.58 120.65,74.3 120.02,74.93 120.02,76.25 U$4.54
13_RX-
  Top 0.406: RS-485_OUT13.2 120.02,73.66 118.75,74.93 118.75,78.16 U$4.53
13_TX+
  Bottom 0.406: RS-485_OUT13.3 121.28,70.48 117.47,74.3 117.47,76.25 U$4.52
13_TX-
  Bottom 0.406: RS-485_OUT13.6 125.09,67.94 118.75,74.3 118.75,76.83 118.11,77.47 117.03,77.47 U$4.51
14_RX+
  Top 0.406: RS-485_OUT14.1 109.43,44.02 111.12,45.72 111.12,48.9 113.67,51.44 113.67,73.66 114.94,74.93 114.94,76.25 U$4.50
14_RX-
  Top 0.406: RS-485_OUT14.2 109.86,48.9 113.03,52.07 113.03,74.3 113.67,74.93 113.67,78.16 U$4.49
14_TX+
  Bottom 0.406: RS-485_OUT14.3 111.12,74.98 U$4.48
14_TX-
  Bottom 0.406: RS-485_OUT14.6 114.72,46.56 111.76,49.53 111.76,73.66 113.67,75.56 113.67,76.83 113.03,77.47 111.95,77.47 U$4.47
15_RX+
  Top 0.406: RS-485_OUT15.1 98,64.34 99.69,66.04 99.69,67.31 106.05,73.66 108.58,73.66 109.86,74.93 109.86,76.25 U$4.46
15_RX-
  Top 0.406: RS-485_OUT15.2 98.42,67.31 105.41,74.3 107.95,74.3 108.58,74.93 108.58,78.16 U$4.45
15_TX+
  Bottom 0.406: RS-485_OUT15.3 100.54,64.34 101.6,65.41 104.14,65.41 104.78,66.04 104.78,72.39 107.31,74.93 107.31,76.25 U$4.44
15_TX-
  Bottom 0.406: RS-485_OUT15.6 103.5,72.39 106.05,74.93 106.05,78.16 U$4.43
16_RX+
  Top 0.406: RS-485_OUT16.1 87.84,44.02 89.53,45.72 89.53,48.9 92.08,51.44 92.08,67.94 95.25,71.12 100.97,71.12 104.78,74.93 104.78,76.25 U$4.42
16_RX-
  Top 0.406: RS-485_OUT16.2 88.27,48.9 91.44,52.07 91.44,68.58 94.61,71.75 100.33,71.75 103.5,74.93 103.5,78.16 U$4.41
16_TX+
  Bottom 0.406: RS-485_OUT16.3 89.53,67.94 96.52,74.93 100.91,74.93 U$4.40
16_TX-
  Bottom 0.406: RS-485_OUT16.6 93.14,46.56 90.17,49.53 90.17,67.31 97.16,74.3 102.23,74.3 103.5,75.56 103.5,76.83 102.87,77.47 101.79,77.47 U$4.39
17_RX+
  Top 0.406: RS-485_OUT17.1 76.41,64.34 78.11,66.04 78.11,67.31 83.19,72.39 97.79,72.39 99.69,74.3 99.69,76.25 U$4.38
17_RX-
  Top 0.406: RS-485_OUT17.2 76.83,67.31 82.55,73.03 96.52,73.03 98.42,74.93 98.42,78.16 U$4.37
17_TX+
  Bottom 0.406: RS-485_OUT17.3 78.82,64.34 80.01,65.53 82.3,65.53 83.06,66.29 83.06,70.99 86.36,74.3 94.61,74.3 96.52,76.2 97.1,76.2 U$4.36
17_TX-
  Bottom 0.406: RS-485_OUT17.6 81.92,71.12 85.72,74.93 93.98,74.93 95.89,76.83 95.89,78.16 U$4.35
+5V
  Top 0.406: 64.26,45.21 64.26,50.29 | 73.15,50.29 73.15,44.96 | 71.88,50.29 71.88,44.96 | 70.61,50.29 70.61,44.96 | 69.34,50.29 69.34,44.96 | 68.07,50.29 68.07,44.96 | 66.8,50.29 66.8,44.96 | 65.53,50.29 65.53,44.96 | 74.42,44.96 74.42,50.29
  pour Top: 64.26,44.96 64.26,0.25 197.87,0.25 197.87,35.31 74.42,35.31 74.42,44.96
  pour Top: 64.26,50.29 81.03,50.29 81.03,41.66 176.28,41.66 176.28,116.33 103.63,116.33 103.63,107.7 64.26,107.7
GND
  Top 0.254: U$5.P$1 53.85,54.61 | U$3.P$1 53.59,71.12 53.85,70.87 | U$2.P$1 53.34,87.12 53.85,86.61 | U$1.P$1 53.34,103.89 53.85,103.38 | U$6.P$1 53.34,36.32 53.85,35.81
  Top 6.452: 12V_HIGH_POWER.R1 12V_HIGH_POWER.R2 53.85,35.81 53.85,54.61 53.85,70.87 53.85,86.61 53.85,103.38 53.85,120.9
  Bottom 0.406: 53.85,120.9 53.34,120.9 U$8.P$1 | 53.85,35.81 65.02,35.81
  Bottom 6.452: 12V_HIGH_POWER.R1 53.85,35.81 53.85,120.9
  pour Bottom: 64.26,107.7 64.26,0.25 197.87,0.25 197.87,30.99 176.28,30.99 176.28,116.33 103.63,116.33 103.63,107.7
N$1
  Top 0.406: ETH_INT1.1 87.38,22.05 87.38,16.14 arc-90 86.98,15.75 86.63,15.75 arc90 86.23,15.35 86.23,15.01 arc90 86.63,14.62 86.98,14.62 arc-90 87.38,14.22 87.38,8.43 ETH_EXT1.1
N$2
  Top 0.406: ETH_EXT1.2 ETH_INT1.2
N$3
  Top 0.406: ETH_INT1.3 80.64,22.07 arc-90 80.25,21.67 80.07,21.67 arc90 79.67,21.28 79.67,21.28 arc90 80.07,20.88 80.25,20.88 arc-90 80.64,20.49 80.64,20.49 arc-90 80.25,20.09 80.07,20.09 arc90 79.67,19.7 79.67,19.7 arc90 80.07,19.3 80.25,19.3 arc-90 80.64,18.91 80.64,18.91 arc-90 80.25,18.51 80.07,18.51 arc90 79.67,18.12 79.67,18.12 arc90 80.07,17.72 80.25,17.72 arc-90 80.64,17.33 80.64,17.32 arc-90 80.25,16.93 80.07,16.93 arc90 79.67,16.54 79.67,16.54 arc90 80.07,16.14 80.25,16.14 arc-90 80.64,15.75 ETH_EXT1.3
N$4
  pour Bottom (no thermals): 21.08,124.71 21.08,101.35 20.07,100.33 16,100.33 11.43,104.9 11.43,121.16 16,125.73 20.07,125.73
  pour Top (no thermals): 21.08,101.35 21.08,124.71 20.07,125.73 16,125.73 11.43,121.16 11.43,104.9 16,100.33 20.07,100.33
N$5
  pour Top (no thermals): 22.1,124.71 22.1,101.35 23.11,100.33 27.18,100.33 31.75,104.9 31.75,121.16 27.18,125.73 23.11,125.73
  pour Bottom (no thermals): 22.1,101.35 22.1,124.71 23.11,125.73 27.18,125.73 31.75,121.16 31.75,104.9 27.18,100.33 23.11,100.33
N$6
  Top 0.406: ETH_INT1.6 ETH_EXT1.6
N$7
  pour Top (no thermals): 21.08,72.14 21.08,95.5 20.07,96.52 16,96.52 11.43,91.95 11.43,75.69 16,71.12 20.07,71.12
  pour Bottom (no thermals): 21.08,95.5 21.08,72.14 20.07,71.12 16,71.12 11.43,75.69 11.43,91.95 16,96.52 20.07,96.52
N$8
  pour Bottom (no thermals): 22.1,72.14 22.1,95.5 23.11,96.52 27.18,96.52 31.75,91.95 31.75,75.69 27.18,71.12 23.11,71.12
  pour Top (no thermals): 22.1,95.5 22.1,72.14 23.11,71.12 27.18,71.12 31.75,75.69 31.75,91.95 27.18,96.52 23.11,96.52
N$9
  Top 0.406: ETH_INT2.1 108.97,22.05 108.97,16.1 arc-90 108.57,15.71 108.22,15.71 arc90 107.82,15.31 107.82,15.27 arc90 108.22,14.87 108.57,14.87 arc-90 108.97,14.48 108.97,8.43 ETH_EXT2.1
N$10
  Top 0.406: ETH_EXT2.2 103.5,7.62 103.5,8.26 ETH_INT2.2
N$11
  Top 0.406: ETH_INT2.3 102.23,21.59 arc-90 101.84,21.19 101.74,21.19 arc90 101.35,20.8 101.35,20.76 arc90 101.74,20.36 101.84,20.36 arc-90 102.23,19.97 102.23,19.93 arc-90 101.84,19.53 101.74,19.53 arc90 101.35,19.14 101.35,19.09 arc90 101.74,18.7 101.84,18.7 arc-90 102.23,18.31 102.23,18.26 arc-90 101.84,17.87 101.74,17.87 arc90 101.35,17.48 101.35,17.43 arc90 101.74,17.04 101.84,17.04 arc-90 102.23,16.65 102.23,16.6 arc-90 101.84,16.21 101.74,16.21 arc90 101.35,15.82 101.35,15.77 arc90 101.74,15.38 101.84,15.38 arc-90 102.23,14.99 ETH_EXT2.3
N$12
  pour Bottom (no thermals): 21.08,66.29 21.08,42.93 20.07,41.91 16,41.91 11.43,46.48 11.43,62.74 16,67.31 20.07,67.31
  pour Top (no thermals): 21.08,42.93 21.08,66.29 20.07,67.31 16,67.31 11.43,62.74 11.43,46.48 16,41.91 20.07,41.91
N$13
  pour Bottom (no thermals): 22.1,42.93 22.1,66.29 23.11,67.31 27.18,67.31 31.75,62.74 31.75,46.48 27.18,41.91 23.11,41.91
  pour Top (no thermals): 22.1,66.29 22.1,42.93 23.11,41.91 27.18,41.91 31.75,46.48 31.75,62.74 27.18,67.31 23.11,67.31
N$14
  Top 0.406: ETH_INT2.6 ETH_EXT2.6
N$15
  pour Bottom (no thermals): 187.45,66.55 187.45,43.18 186.44,42.16 182.37,42.16 177.8,46.74 177.8,62.99 182.37,67.56 186.44,67.56
  pour Top (no thermals): 187.45,43.18 187.45,66.55 186.44,67.56 182.37,67.56 177.8,62.99 177.8,46.74 182.37,42.16 186.44,42.16
N$16
  pour Bottom (no thermals): 188.47,43.18 188.47,66.55 189.48,67.56 193.55,67.56 198.12,62.99 198.12,46.74 193.55,42.16 189.48,42.16
  pour Top (no thermals): 188.47,66.55 188.47,43.18 189.48,42.16 193.55,42.16 198.12,46.74 198.12,62.99 193.55,67.56 189.48,67.56
N$17
  Top 0.406: ETH_INT3.1 130.56,22.05 130.56,15.56 arc-90 130.16,15.16 129.81,15.16 arc90 129.41,14.77 129.41,14.5 arc90 129.81,14.11 130.16,14.11 arc-90 130.56,13.72 130.56,8.43 ETH_EXT3.1
N$18
  Top 0.406: ETH_INT3.2 ETH_EXT3.2
N$19
  Top 0.406: ETH_INT3.3 123.83,21.8 arc-90 123.43,21.41 arc90 123.04,21.02 123.04,20.98 arc90 123.43,20.59 arc-90 123.83,20.19 123.83,20.15 arc-90 123.43,19.76 arc90 123.04,19.37 123.04,19.33 arc90 123.43,18.93 arc-90 123.83,18.54 123.83,18.5 arc-90 123.43,18.11 arc90 123.04,17.72 123.04,17.68 arc90 123.43,17.28 arc-90 123.83,16.89 123.83,16.85 arc-90 123.43,16.46 arc90 123.04,16.07 123.04,16.03 arc90 123.43,15.63 arc-90 123.83,15.24 ETH_EXT3.3
N$20
  pour Bottom (no thermals): 187.45,95.5 187.45,72.14 186.44,71.12 182.37,71.12 177.8,75.69 177.8,91.95 182.37,96.52 186.44,96.52
  pour Top (no thermals): 187.45,72.14 187.45,95.5 186.44,96.52 182.37,96.52 177.8,91.95 177.8,75.69 182.37,71.12 186.44,71.12
N$21
  pour Top (no thermals): 188.47,95.5 188.47,72.14 189.48,71.12 193.55,71.12 198.12,75.69 198.12,91.95 193.55,96.52 189.48,96.52
  pour Bottom (no thermals): 188.47,72.14 188.47,95.5 189.48,96.52 193.55,96.52 198.12,91.95 198.12,75.69 193.55,71.12 189.48,71.12
N$22
  Top 0.406: ETH_INT3.6 ETH_EXT3.6
N$23
  pour Bottom (no thermals): 187.45,124.71 187.45,101.35 186.44,100.33 182.37,100.33 177.8,104.9 177.8,121.16 182.37,125.73 186.44,125.73
  pour Top (no thermals): 187.45,101.35 187.45,124.71 186.44,125.73 182.37,125.73 177.8,121.16 177.8,104.9 182.37,100.33 186.44,100.33
N$24
  pour Top (no thermals): 188.47,124.71 188.47,101.35 189.48,100.33 193.55,100.33 198.12,104.9 198.12,121.16 193.55,125.73 189.48,125.73
  pour Bottom (no thermals): 188.47,101.35 188.47,124.71 189.48,125.73 193.55,125.73 198.12,121.16 198.12,104.9 193.55,100.33 189.48,100.33
N$25
  Bottom 1.778: 29V-LOW_POWER_EXT.R 29V_LO_POWER_INT.L
N$27
  Top 0.406: ETH_INT4.6 ETH_EXT4.6
N$28
  Bottom 1.778: 29V_LO_POWER_INT.R 29V-LOW_POWER_EXT.L
N$29
  pour Top: 13.97,30.73 41.4,30.73 41.4,0 13.97,0
N$30
  Top 0.406: ETH_INT4.3 145.41,21.26 arc-90 145.02,20.86 arc90 144.63,20.47 144.63,20.44 arc90 145.02,20.05 arc-90 145.41,19.65 145.41,19.62 arc-90 145.02,19.23 arc90 144.63,18.83 144.63,18.8 arc90 145.02,18.41 arc-90 145.41,18.01 145.41,17.98 arc-90 145.02,17.59 arc90 144.63,17.19 144.63,17.16 arc90 145.02,16.77 arc-90 145.41,16.37 145.41,16.34 arc-90 145.02,15.95 arc90 144.63,15.55 144.63,15.52 arc90 145.02,15.13 arc-90 145.41,14.73 ETH_EXT4.3
N$31
  Top 0.406: ETH_INT4.2 ETH_EXT4.2
N$32
  Top 0.406: ETH_INT4.1 152.15,22.05 152.15,16.12 arc-90 151.75,15.73 151.4,15.73 arc90 151,15.34 151,15.01 arc90 151.4,14.62 151.75,14.62 arc-90 152.15,14.22 152.15,8.43 ETH_EXT4.1
N$33
  pour Bottom: 13.97,30.73 41.4,30.73 41.4,0 13.97,0
N$35
  Top 0.406: ETH_INT5.6 ETH_EXT5.6
N$38
  Top 0.406: ETH_INT5.3 167,22.52 arc-90 166.61,22.13 166.51,22.13 arc90 166.12,21.74 166.12,21.67 arc90 166.51,21.27 166.61,21.27 arc-90 167,20.88 167,20.81 arc-90 166.61,20.42 166.51,20.42 arc90 166.12,20.03 166.12,19.96 arc90 166.51,19.56 166.61,19.56 arc-90 167,19.17 167,19.1 arc-90 166.61,18.71 166.51,18.71 arc90 166.12,18.32 166.12,18.25 arc90 166.51,17.85 166.61,17.85 arc-90 167,17.46 167,17.39 arc-90 166.61,17 166.51,17 arc90 166.12,16.6 166.12,16.54 arc90 166.51,16.14 166.61,16.14 arc-90 167,15.75 ETH_EXT5.3
N$39
  Top 0.406: ETH_INT5.2 ETH_EXT5.2
N$40
  Top 0.406: ETH_INT5.1 173.74,22.05 173.74,15.68 arc-90 173.34,15.29 172.99,15.29 arc90 172.59,14.89 172.59,14.76 arc90 172.99,14.36 173.34,14.36 arc-90 173.74,13.97 173.74,8.43 ETH_EXT5.1
N$41
  Top 0.406: ETH_INT6.1 195.33,22.05 195.33,16.16 arc-90 194.93,15.77 194.58,15.77 arc90 194.18,15.37 194.18,15.27 arc90 194.58,14.87 194.93,14.87 arc-90 195.33,14.48 195.33,8.43 ETH_EXT6.1
N$42
  Top 0.406: ETH_INT6.2 ETH_EXT6.2
N$43
  Top 0.406: ETH_INT6.3 188.59,21.5 arc-90 188.2,21.11 188.02,21.11 arc90 187.62,20.71 187.62,20.64 arc90 188.02,20.25 188.2,20.25 arc-90 188.59,19.86 188.59,19.79 arc-90 188.2,19.4 188.02,19.4 arc90 187.62,19 187.62,18.94 arc90 188.02,18.54 188.2,18.54 arc-90 188.59,18.15 188.59,18.08 arc-90 188.2,17.69 188.02,17.69 arc90 187.62,17.3 187.62,17.23 arc90 188.02,16.83 188.2,16.83 arc-90 188.59,16.44 188.59,16.37 arc-90 188.2,15.98 188.02,15.98 arc90 187.62,15.59 187.62,15.52 arc90 188.02,15.13 188.2,15.13 arc-90 188.59,14.73 ETH_EXT6.3
N$46
  Top 0.406: ETH_INT6.6 ETH_EXT6.6
N$61
  Top 0.406: ETH_INT7.1 31.5,22.05 31.5,16.26 arc-90 31.1,15.86 30.75,15.86 arc90 30.35,15.47 30.35,15.41 arc90 30.75,15.02 31.1,15.02 arc-90 31.5,14.62 31.5,8.43 ETH_EXT7.1
N$62
  Top 0.406: ETH_EXT7.2 ETH_INT7.2
N$63
  Top 0.406: ETH_EXT7.3 24.77,15.84 arc90 24.37,16.24 24.19,16.24 arc-90 23.79,16.63 23.79,16.7 arc-90 24.19,17.09 24.37,17.09 arc90 24.77,17.48 24.77,17.55 arc90 24.37,17.94 24.19,17.94 arc-90 23.79,18.34 23.79,18.4 arc-90 24.19,18.8 24.37,18.8 arc90 24.77,19.19 24.77,19.26 arc90 24.37,19.65 24.19,19.65 arc-90 23.79,20.05 23.79,20.11 arc-90 24.19,20.5 24.37,20.5 arc90 24.77,20.9 24.77,20.96 arc90 24.37,21.36 24.19,21.36 arc-90 23.79,21.75 23.79,21.82 arc-90 24.19,22.21 24.37,22.21 arc90 24.77,22.61 ETH_INT7.3
N$66
  Top 0.406: ETH_EXT7.6 ETH_INT7.6
V+
  Top 0.254: U$8.P$2 46.48,120.65 46.23,120.4 | U$1.P$2 46.48,104.14 46.23,104.39 | U$2.P$2 46.74,87.63 46.23,87.12 | U$3.P$2 46.74,71.12 46.23,70.61 | U$5.P$2 46.23,54.61 | 46.23,54.61 45.97,54.61 45.72,54.86 45.97,54.86 46.23,54.61 | U$6.P$2 47.24,37.85 46.99,37.85 46.23,38.61
  Top 6.452: 12V_HIGH_POWER.L1 12V_HIGH_POWER.L2 46.23,38.61 46.23,54.61 46.23,70.61 46.23,87.12 46.23,104.39 46.23,120.4 46.23,120.9
  Bottom 6.452: 12V_HIGH_POWER.L1 46.23,120.9

### Text on the board
tPlace: Cut to disable PoRC
tNames: GPS PASSTHRU | 2 | 1 | 5 | 3 | 4 | 6 | 7 | 8 | 9 | 17 | 16 | 15 | 14 | 13 | 11 | 10 | 12
bStop: ALL I DO IS ROVE ROVE ROVE NO MATTER WHAT